# EAGLE schematic narsil (EAGLE 6.1)
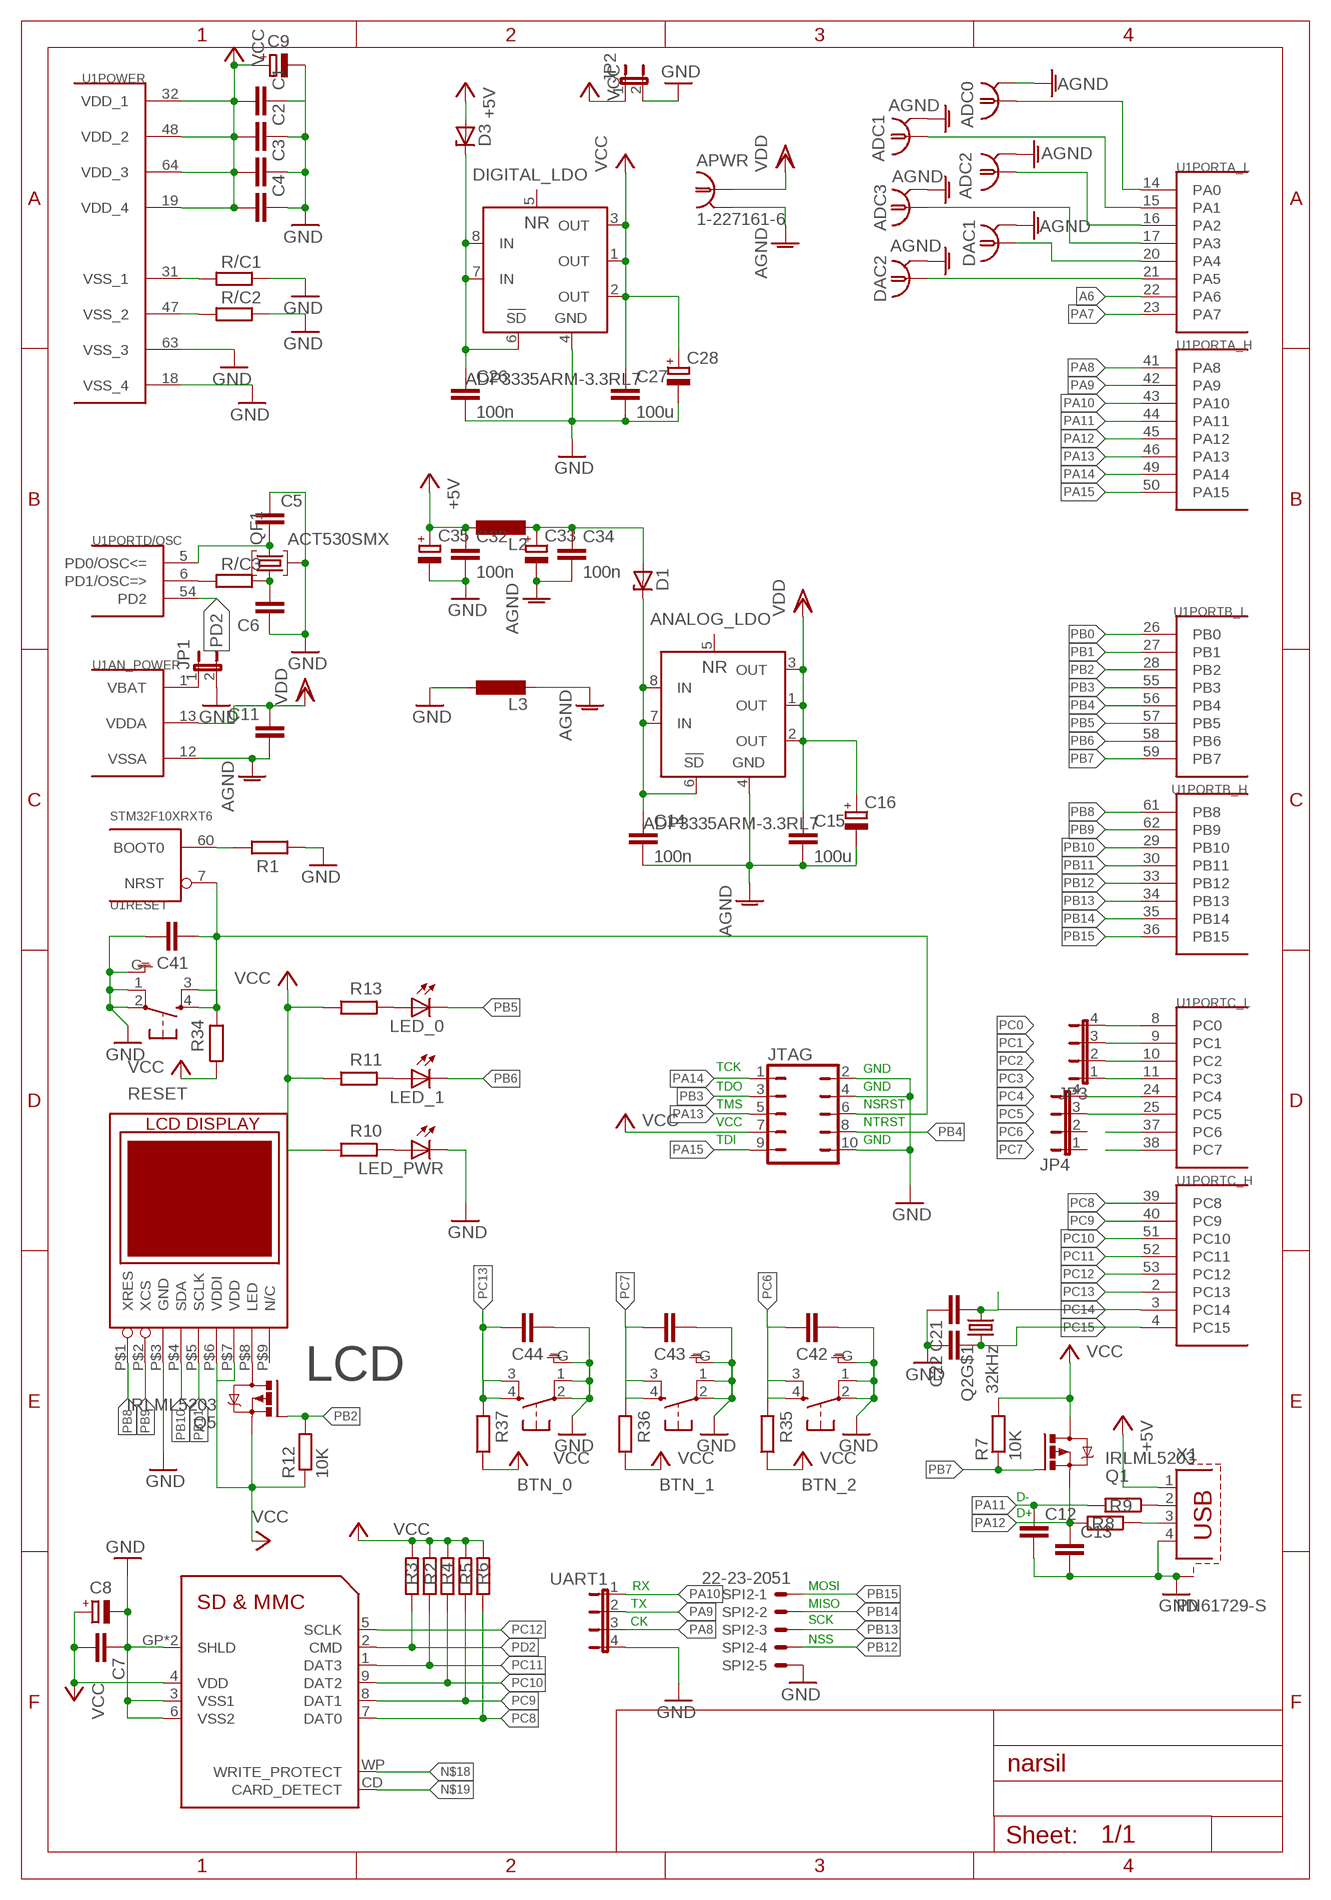
[diagram p0: schematic, sheet 1]

## Parts
ADC0  1-227161-6  [AMP_227161]
ADC1  1-227161-6  [AMP_227161]
ADC2  1-227161-6  [AMP_227161]
ADC3  1-227161-6  [AMP_227161]
ANALOG_LDO  ADP3335ARM-3.3RL7  [MSOP08]
APWR  1-227161-6  [AMP_227161]
BTN_0  10-XXG  [B3F-10XXG]
BTN_1  10-XXG  [B3F-10XXG]
BTN_2  10-XXG  [B3F-10XXG]
C1  C-EUC0805  [C0805]
C2  C-EUC0805  [C0805]
C3  C-EUC0805  [C0805]
C4  C-EUC0805  [C0805]
C5  C-EUC0805  [C0805]
C6  C-EUC0805  [C0805]
C7  C-EUC0805  [C0805]
C8  CPOL-EUSMCA  [SMC_A]
C9  CPOL-EUSMCA  [SMC_A]
C11  C-EUC0805  [C0805]
C12  C-EUC0805  [C0805]
C13  C-EUC0805  [C0805]
C14  100n  C-EUC0805  [C0805]
C15  100u  C-EUC0805  [C0805]
C16  CPOL-EUSMCA  [SMC_A]
C21  C-EUC0805  [C0805]
C22  C-EUC0805  [C0805]
C26  100n  C-EUC0805  [C0805]
C27  100u  C-EUC0805  [C0805]
C28  CPOL-EUSMCA  [SMC_A]
C32  100n  C-EUC0805  [C0805]
C33  CPOL-EUSMCA  [SMC_A]
C34  100n  C-EUC0805  [C0805]
C35  CPOL-EUSMCA  [SMC_A]
C41  C-EUC0805  [C0805]
C42  C-EUC0805  [C0805]
C43  C-EUC0805  [C0805]
C44  C-EUC0805  [C0805]
D1  ZENER-DIODESMB  [SMB]
D3  ZENER-DIODESMB  [SMB]
DAC1  1-227161-6  [AMP_227161]
DAC2  1-227161-6  [AMP_227161]
DIGITAL_LDO  ADP3335ARM-3.3RL7  [MSOP08]
JP1  JP1E  [JP1]
JP2  JP1E  [JP1]
JP3  JP4E  [JP4]
JP4  JP4E  [JP4]
JTAG  JP5Q  [JP5Q]
L2  L-EUL1206  [R1206]
L3  L-EUL1206  [R1206]
LED_0  LEDSMT1206  [1206]
LED_1  LEDSMT1206  [1206]
LED_PWR  LEDSMT1206  [1206]
Q1  IRLML5203  [MICRO3]
Q2  32kHz  MC146  [MC146]
Q5  IRLML5203  [MICRO3]
QF1  ACT530SMX  [ACT530SMX]
R1  5k  R-EU_M0805  [M0805]
R2  47k  R-EU_M0805  [M0805]
R3  47k  R-EU_M0805  [M0805]
R4  47k  R-EU_M0805  [M0805]
R5  47k  R-EU_M0805  [M0805]
R6  47k  R-EU_M0805  [M0805]
R7  10K  R-EU_M0805  [M0805]
R8  47k  R-EU_M0805  [M0805]
R9  47k  R-EU_M0805  [M0805]
R10  5k  R-EU_M0805  [M0805]
R11  5k  R-EU_M0805  [M0805]
R12  10K  R-EU_M0805  [M0805]
R13  5k  R-EU_M0805  [M0805]
R34  5k  R-EU_M0805  [M0805]
R35  5k  R-EU_M0805  [M0805]
R36  5k  R-EU_M0805  [M0805]
R37  5k  R-EU_M0805  [M0805]
R/C1  R-EU_M0805  [M0805]
R/C2  R-EU_M0805  [M0805]
R/C3  R-EU_M0805  [M0805]
RESET  10-XXG  [B3F-10XXG]
SPI2  22-23-2051  [22-23-2051]
U1  STM32F10XRXT6  [TQFP64]
U$1  SD-RSMT-2-MQ  [SD-RSMT-2-MQ]
U$2  LCD  [LCD_NOKIA1100]
UART1  JP4E  [JP4]
X1  PN61729-S  [PN61729-S]

## Nets
+5V: C32.1 C35.+ D3.A L2.1 X1.1
A6: U1.22(PORTA_L:PA6)
AGND: ADC0.2(GND) ADC1.2(GND) ADC2.2(GND) ADC3.2(GND) ANALOG_LDO.4(GND) APWR.2(GND) C11.2 C14.2 C15.2 C16.- C33.- C34.2 DAC1.2(GND) DAC2.2(GND) L3.2 U1.12(AN_POWER:VSSA)
GND: BTN_0.1 BTN_0.2(P) BTN_0.G(GND) BTN_1.1 BTN_1.2(P) BTN_1.G(GND) BTN_2.1 BTN_2.2(P) BTN_2.G(GND) C1.1 C2.1 C3.1 C4.1 C5.1 C6.1 C7.1 C8.- C9.- C12.2 C13.2 C21.1 C22.1 C26.2 C27.2 C28.- C32.2 C35.- C41.1 C42.1 C43.1 C44.1 DIGITAL_LDO.4(GND) JP1.2 JP2.2 JTAG.2 JTAG.4 JTAG.10 L3.1 LED_PWR.C QF1.S$1 QF1.S$2 R1.1 R/C1.1 R/C2.1 RESET.1 RESET.2(P) RESET.G(GND) SPI2.5 U1.18(POWER:VSS_4) U1.63(POWER:VSS_3) U$1.3(VSS1) U$1.6(VSS2) U$1.GP2(SHLD) U$1.GP(SHLD) U$2.P$3(GND) UART1.4 X1.4 X1.SHLD@1(S1) X1.SHLD@2(S1)
N$1: R/C2.2 U1.47(POWER:VSS_2)
N$2: R/C1.2 U1.31(POWER:VSS_1)
N$3: C5.2 QF1.P2 U1.5(PORTD/OSC:PD0/OSC<=)
N$4: C6.2 QF1.P1 R/C3.1
N$5: DAC1.1 U1.20(PORTA_L:PA4)
N$6: DAC2.1 U1.21(PORTA_L:PA5)
N$7: ADC3.1 U1.17(PORTA_L:PA3)
N$8: ADC2.1 U1.16(PORTA_L:PA2)
N$9: ADC1.1 U1.15(PORTA_L:PA1)
N$10: ADC0.1 U1.14(PORTA_L:PA0)
N$11: R1.2 U1.60(RESET:BOOT0)
N$12: Q5.3(D) U$2.P$8(LED)
N$13: LED_PWR.A R10.2
N$14: R9.1 X1.2
N$15: LED_1.A R11.2
N$16: R8.1 X1.3
N$17: LED_0.A R13.2
N$18: U$1.WP(WRITE_PROTECT)
N$19: U$1.CD(CARD_DETECT)
N$20: JP1.1 U1.1(AN_POWER:VBAT)
N$21: ANALOG_LDO.6(SD/) ANALOG_LDO.7(IN) ANALOG_LDO.8(IN) C14.1 D1.C
N$22: R/C3.2 U1.6(PORTD/OSC:PD1/OSC=>)
N$23: C33.+ C34.1 D1.A L2.2
N$28: C41.2 JTAG.6 R34.2 RESET.3(S1) RESET.4(S) U1.7(RESET:NRST)
N$32: C26.1 D3.C DIGITAL_LDO.6(SD/) DIGITAL_LDO.7(IN) DIGITAL_LDO.8(IN)
PA7: U1.23(PORTA_L:PA7)
PA8: U1.41(PORTA_H:PA8) UART1.3
PA9: U1.42(PORTA_H:PA9) UART1.2
PA10: U1.43(PORTA_H:PA10) UART1.1
PA11: C12.1 R9.2 U1.44(PORTA_H:PA11)
PA12: C13.1 Q1.2(S) R8.2 U1.45(PORTA_H:PA12)
PA13: JTAG.5 U1.46(PORTA_H:PA13)
PA14: JTAG.1 U1.49(PORTA_H:PA14)
PA15: JTAG.9 U1.50(PORTA_H:PA15)
PB0: U1.26(PORTB_L:PB0)
PB1: U1.27(PORTB_L:PB1)
PB2: Q5.1(G) R12.2 U1.28(PORTB_L:PB2)
PB3: JTAG.3 U1.55(PORTB_L:PB3)
PB4: JTAG.8 U1.56(PORTB_L:PB4)
PB5: LED_0.C U1.57(PORTB_L:PB5)
PB6: LED_1.C U1.58(PORTB_L:PB6)
PB7: Q1.1(G) R7.1 U1.59(PORTB_L:PB7)
PB8: U1.61(PORTB_H:PB8) U$2.P$1(XRES)
PB9: U1.62(PORTB_H:PB9) U$2.P$2(XCS)
PB10: U1.29(PORTB_H:PB10) U$2.P$4(SDA)
PB11: U1.30(PORTB_H:PB11) U$2.P$5(SCLK)
PB12: SPI2.4 U1.33(PORTB_H:PB12)
PB13: SPI2.3 U1.34(PORTB_H:PB13)
PB14: SPI2.2 U1.35(PORTB_H:PB14)
PB15: SPI2.1 U1.36(PORTB_H:PB15)
PC0: JP3.4 U1.8(PORTC_L:PC0)
PC1: JP3.3 U1.9(PORTC_L:PC1)
PC2: JP3.2 U1.10(PORTC_L:PC2)
PC3: JP3.1 U1.11(PORTC_L:PC3)
PC4: JP4.4 U1.24(PORTC_L:PC4)
PC5: JP4.3 U1.25(PORTC_L:PC5)
PC6: BTN_2.3(S1) BTN_2.4(S) C42.2 R35.2 U1.37(PORTC_L:PC6)
PC7: BTN_1.3(S1) BTN_1.4(S) C43.2 R36.2 U1.38(PORTC_L:PC7)
PC8: R6.1 U1.39(PORTC_H:PC8) U$1.7(DAT0)
PC9: R5.1 U1.40(PORTC_H:PC9) U$1.8(DAT1)
PC10: R4.1 U1.51(PORTC_H:PC10) U$1.9(DAT2)
PC11: R2.1 U1.52(PORTC_H:PC11) U$1.1(DAT3)
PC12: U1.53(PORTC_H:PC12) U$1.5(SCLK)
PC13: BTN_0.3(S1) BTN_0.4(S) C44.2 R37.2 U1.2(PORTC_H:PC13)
PC14: C21.2 Q2.P$1 U1.3(PORTC_H:PC14)
PC15: C22.2 Q2.P$2 U1.4(PORTC_H:PC15)
PD2: R3.1 U1.54(PORTD/OSC:PD2) U$1.2(CMD)
VCC: C1.2 C2.2 C3.2 C4.2 C7.2 C8.+ C9.+ C27.1 C28.+ DIGITAL_LDO.1(OUT) DIGITAL_LDO.2(OUT) DIGITAL_LDO.3(OUT) JP2.1 JTAG.7 Q1.3(D) Q5.2(S) R2.2 R3.2 R4.2 R5.2 R6.2 R7.2 R10.1 R11.1 R12.1 R13.1 R34.1 R35.1 R36.1 R37.1 U1.19(POWER:VDD_4) U1.32(POWER:VDD_1) U1.48(POWER:VDD_2) U1.64(POWER:VDD_3) U$1.4(VDD) U$2.P$6(VDDI) U$2.P$7(VDD)
VDD: ANALOG_LDO.1(OUT) ANALOG_LDO.2(OUT) ANALOG_LDO.3(OUT) APWR.1 C11.1 C15.1 C16.+ U1.13(AN_POWER:VDDA)
Unconnected: ANALOG_LDO.5(NR) DIGITAL_LDO.5(NR) JP4.1 JP4.2 U$2.P$9(N/C)

## Notes on the sheet
- TCK | GND
- TDO | GND
- TMS | NSRST
- VCC | NTRST
- TDI | GND
- LCD
- D-
- D+
- RX | MOSI
- TX | MISO
- CK | SCK
- NSS

## Power pins joined to a net without a drawn wire
GND: Q2.GND Q2.GND2(GND)

## Library data of the parts
ADC0 ADC1-ADC3 APWR DAC1 DAC2 = con-coax:?227161*: JACK, RIGHT ANGLE, 50 OHM, PCB, BNC Source: amp_227161.pdf; MF: TYCO ELECTRONICS; MPN: 1-227161-6; OC_FARNELL: unknown; OC_NEWARK: 09H7854
ANALOG_LDO DIGITAL_LDO = analog-devices:ADP3335ARM-3.3
BTN_0 BTN_1 BTN_2 RESET = switch-omron:10-XXG
C1-C7 C11-C13 C21 C22 C32 C34 C41-C44 = resistor:C-EU: CAPACITOR, European symbol
C8 C9 C16 C28 C33 C35 = resistor:CPOL-EU: POLARIZED CAPACITOR, European symbol
C14 C15 C26 C27 = rcl:C-EU: CAPACITOR, European symbol
D1 D3 = diode:ZENER-DIODE: Z-Diode
JP1 JP2 = jumper:JP1E: JUMPER
JP3 JP4 UART1 = jumper:JP4E: JUMPER
JTAG = jumper:JP5Q: JUMPER
L2 L3 = resistor:L-EU: INDUCTOR, European symbol
LED_0 LED_1 LED_PWR = led:LED: LED OSRAM: - CHIPLED LG R971, LG N971, LY N971, LG Q971, LY Q971, LO R971, LY R971 LH N974, LH R974 LS Q976, LO Q976, LY Q976 LO Q996 - Hyper CHIPLED LW Q18S LB Q993, LB Q99A, LB R99A - SideLED LS A670, LO A670, LY A670, LG A670, LP A670 LB A673, LV A673, LT A673, LW A673 LH A674 LY A675 LS A676, LA A676, LO A676, LY A676, LW A676 LS A679, LY A679, LG A679 - Hyper Micro SIDELED® LS Y876, LA Y876, LO Y876, LY Y876 LT Y87S - SmartLED LW L88C, LW L88S LB L89C, LB L89S, LG L890 LS L89K, LO L89K, LY L89K LS L896, LA L896, LO L896, LY L896 - TOPLED LS T670, LO T670, LY T670, LG T670, LP T670 LSG T670, LSP T670, LSY T670, LOP T670, LYG T670 LG T671, LOG T671, LSG T671 LB T673, LV T673, LT T673, LW T673 LH T674 LS T676, LA T676, LO T676, LY T676, LB T676, LH T676, LSB T676, LW T676 LB T67C, LV T67C, LT T67C, LS T67K, LO T67K, LY T67K, LW E67C LS E67B, LA E67B, LO E67B, LY E67B, LB E67C, LV E67C, LT E67C LW T67C LS T679, LY T679, LG T679 LS T770, LO T770, LY T770, LG T770, LP T770 LB T773, LV T773, LT T773, LW T773 LH T774 LS E675, LA E675, LY E675, LS T675 LS T776, LA T776, LO T776, LY T776, LB T776 LHGB T686 LT T68C, LB T68C - Hyper Mini TOPLED® LB M676 - Mini TOPLED Santana® LG M470 LS M47K, LO M47K, LY M47K Source: http://www.osram.convergy.de LUXEON: - LUMILED® LXK2-PW12-R00, LXK2-PW12-S00, LXK2-PW14-U00, LXK2-PW14-V00 LXK2-PM12-R00, LXK2-PM12-S00, LXK2-PM14-U00 LXK2-PE12-Q00, LXK2-PE12-R00, LXK2-PE12-S00, LXK2-PE14-T00, LXK2-PE14-U00 LXK2-PB12-K00, LXK2-PB12-L00, LXK2-PB12-M00, LXK2-PB14-N00, LXK2-PB14-P00, LXK2-PB14-Q00 LXK2-PR12-L00, LXK2-PR12-M00, LXK2-PR14-Q00, LXK2-PR14-R00 LXK2-PD12-Q00, LXK2-PD12-R00, LXK2-PD12-S00 LXK2-PH12-R00, LXK2-PH12-S00 LXK2-PL12-P00, LXK2-PL12-Q00, LXK2-PL12-R00 Source: www.luxeon.com KINGBRIGHT: KA-3528ASYC Source: www.kingbright.com
Q1 Q5 = transistor-power:IRLML5203: HEXFET P-Channel Power MOSFET
Q2 = crystal:MC146
QF1 = crystal:ACT530SMX
R1-R13 R34-R37 R/C1-R/C3 = resistor:R-EU_: RESISTOR, European symbol
SPI2 = con-molex:22-23-2051: .100" (2.54mm) Center Header - 5 Pin; MF: MOLEX; MPN: 22-23-2051; OC_FARNELL: 1462952; OC_NEWARK: 38C9178
U1 = stm32:STM32F10XRXT6: STM32F101/103 64pin LQFP
U$1 = SD-RSMT-2-MQ:SD-RSMT-2-MQ
U$2 = nokia_lcd:LCD
X1 = con-berg:PN61729-S: BERG USB connector; OC_FARNELL: unknown; OC_NEWARK: unknown